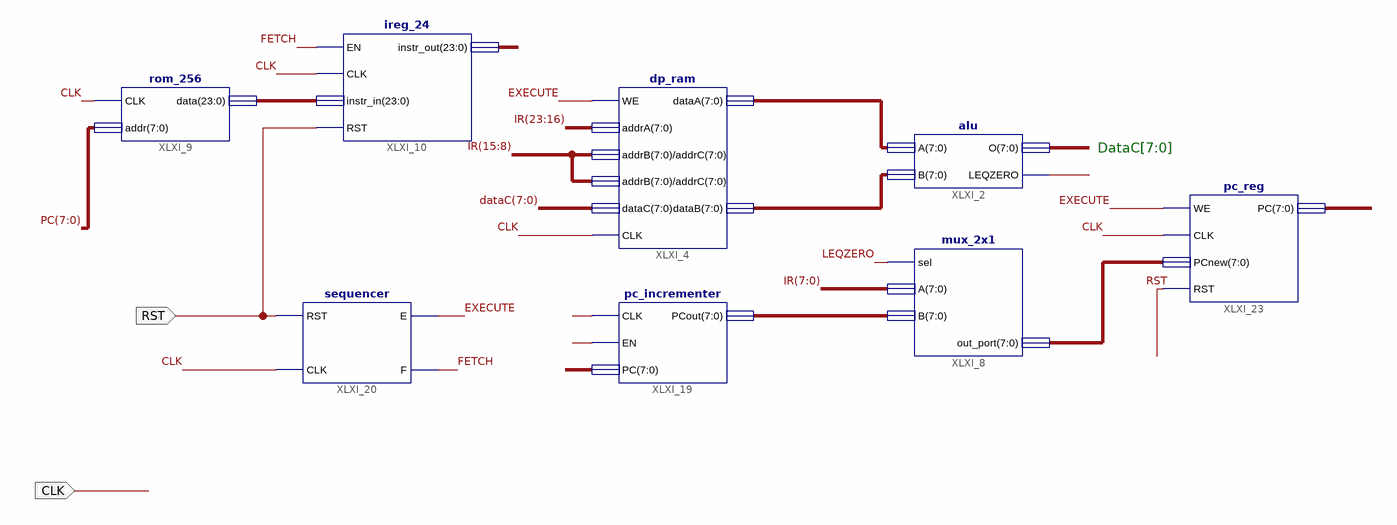
[diagram p0: schematic sheet 1]
// Xilinx ISE schematic subleq_core.sch (spartan3e) as structural Verilog: 8 symbols, 2 ports
module subleq_core (
  input  RST,
  input  CLK
);

  wire EXECUTE, FETCH, LEQZERO;
  wire [7:0] dataA, dataB, dataC, PC, XLXN_78, XLXN_80;
  wire [23:0] IR, XLXN_10;

  alu XLXI_2 (.B(dataB), .A(dataA), .LEQZERO(LEQZERO), .O(dataC));
  dp_ram XLXI_4 (
    .WE(EXECUTE), .addrA(IR[23:16]), .addrB(IR[15:8]), .addrC(IR[15:8]), .dataC(dataC), .dataA(dataA),
    .dataB(dataB), .CLK(CLK));
  mux_2x1 XLXI_8 (.sel(LEQZERO), .A(IR[7:0]), .B(XLXN_78), .out_port(XLXN_80));
  rom_256 XLXI_9 (.CLK(CLK), .addr(PC), .data(XLXN_10));
  ireg_24 XLXI_10 (.EN(FETCH), .CLK(CLK), .RST(RST), .instr_in(XLXN_10), .instr_out(IR));
  pc_incrementer XLXI_19 (.CLK(CLK), .EN(FETCH), .PC(PC), .PCout(XLXN_78));
  sequencer XLXI_20 (.RST(RST), .CLK(CLK), .E(EXECUTE), .F(FETCH));
  pc_reg XLXI_23 (.WE(EXECUTE), .CLK(CLK), .PCnew(XLXN_80), .PC(PC), .RST(RST));

  // Notes on the sheet:
  //   DataC[7:0]
endmodule
